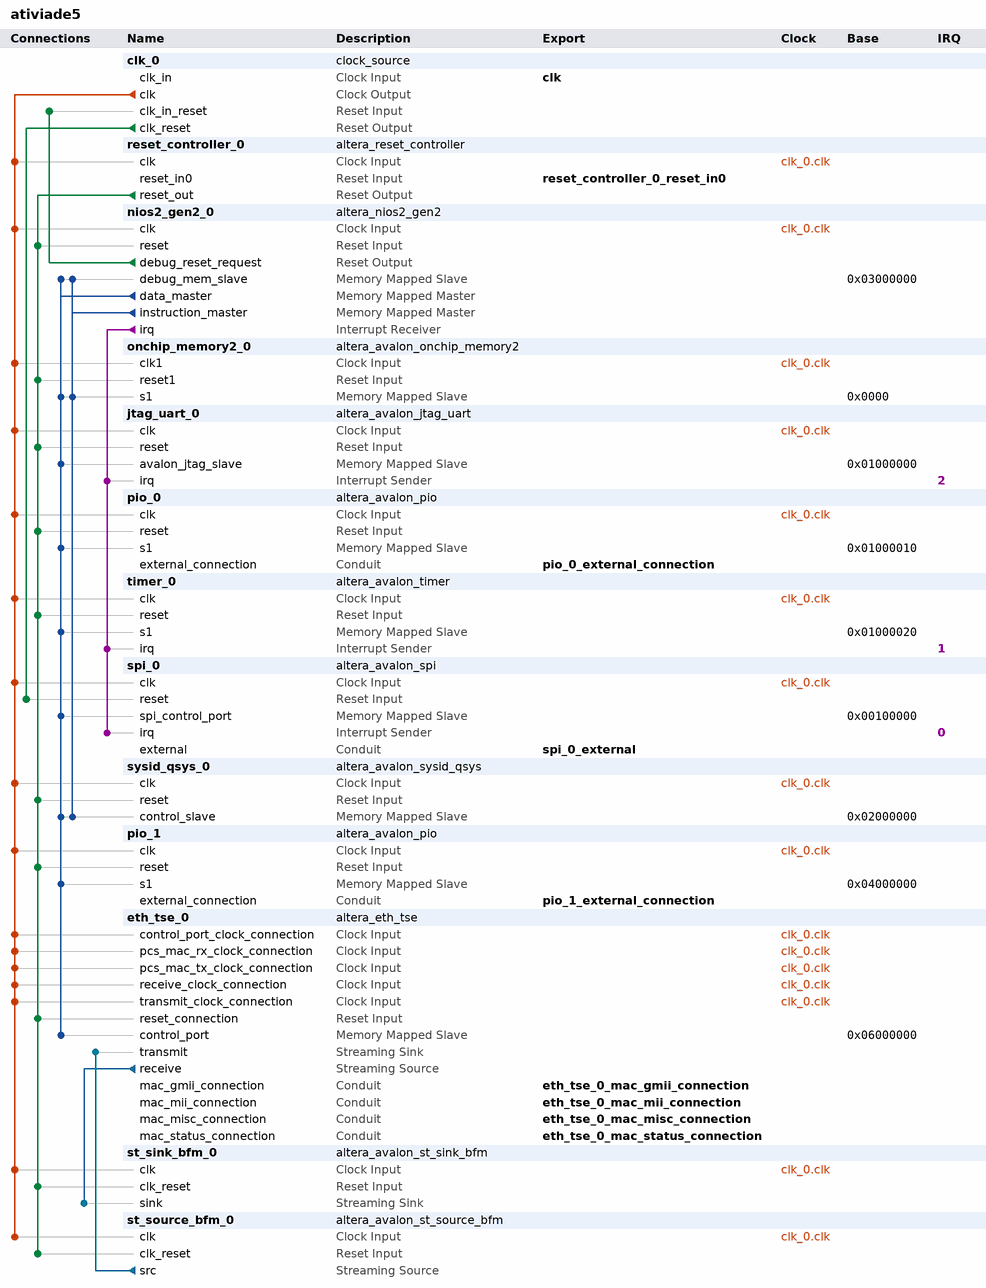
[diagram p0: system contents]
# Platform Designer (Qsys) system ativiade5, Cyclone V 5CSEMA5F31C6
# Parameters at their usual value, and those the tool derives, are not listed.
package require -exact qsys 17.0
create_system ativiade5
set_project_property DEVICE_FAMILY {Cyclone V}
set_project_property DEVICE 5CSEMA5F31C6

add_instance clk_0 clock_source 17.0
set_instance_parameter_value clk_0 clockFrequency 50000000

add_instance reset_controller_0 altera_reset_controller 17.0
set_instance_parameter_value reset_controller_0 NUM_RESET_INPUTS 1
set_instance_parameter_value reset_controller_0 SYNC_DEPTH 2

add_instance nios2_gen2_0 altera_nios2_gen2 17.0
set_instance_parameter_value nios2_gen2_0 dcache_size 2048
set_instance_parameter_value nios2_gen2_0 exceptionSlave onchip_memory2_0.s1
set_instance_parameter_value nios2_gen2_0 icache_size 4096
set_instance_parameter_value nios2_gen2_0 impl Tiny
set_instance_parameter_value nios2_gen2_0 resetSlave onchip_memory2_0.s1

add_instance onchip_memory2_0 altera_avalon_onchip_memory2 17.0
set_instance_parameter_value onchip_memory2_0 dataWidth 32
set_instance_parameter_value onchip_memory2_0 dualPort false
set_instance_parameter_value onchip_memory2_0 initMemContent true
set_instance_parameter_value onchip_memory2_0 initializationFileName onchip_mem.hex
set_instance_parameter_value onchip_memory2_0 memorySize 357300

add_instance jtag_uart_0 altera_avalon_jtag_uart 17.0
set_instance_parameter_value jtag_uart_0 simInteractiveOptions NO_INTERACTIVE_WINDOWS

add_instance pio_0 altera_avalon_pio 17.0
set_instance_parameter_value pio_0 captureEdge true
set_instance_parameter_value pio_0 direction Input
set_instance_parameter_value pio_0 width 10

add_instance timer_0 altera_avalon_timer 17.0
set_instance_parameter_value timer_0 period 1
set_instance_parameter_value timer_0 periodUnits MSEC

add_instance spi_0 altera_avalon_spi 17.0
set_instance_parameter_value spi_0 clockPolarity 0
set_instance_parameter_value spi_0 dataWidth 8
set_instance_parameter_value spi_0 masterSPI true
set_instance_parameter_value spi_0 numberOfSlaves 1
set_instance_parameter_value spi_0 targetClockRate 128000

add_instance sysid_qsys_0 altera_avalon_sysid_qsys 17.0
set_instance_parameter_value sysid_qsys_0 id 0

add_instance pio_1 altera_avalon_pio 17.0
set_instance_parameter_value pio_1 captureEdge true
set_instance_parameter_value pio_1 direction Input
set_instance_parameter_value pio_1 width 1

add_instance eth_tse_0 altera_eth_tse 17.0
set_instance_parameter_value eth_tse_0 core_variation MAC_ONLY
set_instance_parameter_value eth_tse_0 enable_hd_logic true
set_instance_parameter_value eth_tse_0 enable_mac_flow_ctrl false
set_instance_parameter_value eth_tse_0 enable_magic_detect true
set_instance_parameter_value eth_tse_0 enable_shift16 false
set_instance_parameter_value eth_tse_0 ifGMII MII_GMII
set_instance_parameter_value eth_tse_0 ing_addr 11
set_instance_parameter_value eth_tse_0 mdio_clk_div 40
set_instance_parameter_value eth_tse_0 stat_cnt_ena true
set_instance_parameter_value eth_tse_0 transceiver_type NONE
set_instance_parameter_value eth_tse_0 useMDIO false

add_instance st_sink_bfm_0 altera_avalon_st_sink_bfm 17.0
set_instance_parameter_value st_sink_bfm_0 ST_CHANNEL_W 1
set_instance_parameter_value st_sink_bfm_0 ST_ERROR_W 1
set_instance_parameter_value st_sink_bfm_0 ST_MAX_CHANNELS 1
set_instance_parameter_value st_sink_bfm_0 ST_NUMSYMBOLS 4
set_instance_parameter_value st_sink_bfm_0 ST_READY_LATENCY 0
set_instance_parameter_value st_sink_bfm_0 ST_SYMBOL_W 8
set_instance_parameter_value st_sink_bfm_0 USE_CHANNEL 1
set_instance_parameter_value st_sink_bfm_0 USE_EMPTY 1
set_instance_parameter_value st_sink_bfm_0 USE_ERROR 0
set_instance_parameter_value st_sink_bfm_0 USE_PACKET 1
set_instance_parameter_value st_sink_bfm_0 USE_READY 0
set_instance_parameter_value st_sink_bfm_0 USE_VALID 0
set_instance_parameter_value st_sink_bfm_0 VHDL_ID 0

add_instance st_source_bfm_0 altera_avalon_st_source_bfm 17.0
set_instance_parameter_value st_source_bfm_0 ST_CHANNEL_W 1
set_instance_parameter_value st_source_bfm_0 ST_ERROR_W 1
set_instance_parameter_value st_source_bfm_0 ST_MAX_CHANNELS 1
set_instance_parameter_value st_source_bfm_0 ST_NUMSYMBOLS 4
set_instance_parameter_value st_source_bfm_0 ST_SYMBOL_W 8
set_instance_parameter_value st_source_bfm_0 USE_CHANNEL 1
set_instance_parameter_value st_source_bfm_0 USE_EMPTY 1
set_instance_parameter_value st_source_bfm_0 USE_ERROR 0
set_instance_parameter_value st_source_bfm_0 USE_PACKET 1
set_instance_parameter_value st_source_bfm_0 USE_READY 0
set_instance_parameter_value st_source_bfm_0 USE_VALID 0

# connections
add_connection clk_0.clk eth_tse_0.control_port_clock_connection clock
add_connection clk_0.clk eth_tse_0.pcs_mac_rx_clock_connection clock
add_connection clk_0.clk eth_tse_0.pcs_mac_tx_clock_connection clock
add_connection clk_0.clk eth_tse_0.receive_clock_connection clock
add_connection clk_0.clk eth_tse_0.transmit_clock_connection clock
add_connection clk_0.clk jtag_uart_0.clk clock
add_connection clk_0.clk nios2_gen2_0.clk clock
add_connection clk_0.clk onchip_memory2_0.clk1 clock
add_connection clk_0.clk pio_0.clk clock
add_connection clk_0.clk pio_1.clk clock
add_connection clk_0.clk reset_controller_0.clk clock
add_connection clk_0.clk spi_0.clk clock
add_connection clk_0.clk st_sink_bfm_0.clk clock
add_connection clk_0.clk st_source_bfm_0.clk clock
add_connection clk_0.clk sysid_qsys_0.clk clock
add_connection clk_0.clk timer_0.clk clock
add_connection clk_0.clk_reset spi_0.reset reset
add_connection nios2_gen2_0.debug_reset_request clk_0.clk_in_reset reset
add_connection reset_controller_0.reset_out eth_tse_0.reset_connection reset
add_connection reset_controller_0.reset_out jtag_uart_0.reset reset
add_connection reset_controller_0.reset_out nios2_gen2_0.reset reset
add_connection reset_controller_0.reset_out onchip_memory2_0.reset1 reset
add_connection reset_controller_0.reset_out pio_0.reset reset
add_connection reset_controller_0.reset_out pio_1.reset reset
add_connection reset_controller_0.reset_out st_sink_bfm_0.clk_reset reset
add_connection reset_controller_0.reset_out st_source_bfm_0.clk_reset reset
add_connection reset_controller_0.reset_out sysid_qsys_0.reset reset
add_connection reset_controller_0.reset_out timer_0.reset reset
add_connection nios2_gen2_0.data_master eth_tse_0.control_port avalon
set_connection_parameter_value nios2_gen2_0.data_master/eth_tse_0.control_port baseAddress 0x06000000
add_connection nios2_gen2_0.data_master jtag_uart_0.avalon_jtag_slave avalon
set_connection_parameter_value nios2_gen2_0.data_master/jtag_uart_0.avalon_jtag_slave baseAddress 0x01000000
add_connection nios2_gen2_0.data_master nios2_gen2_0.debug_mem_slave avalon
set_connection_parameter_value nios2_gen2_0.data_master/nios2_gen2_0.debug_mem_slave baseAddress 0x03000000
add_connection nios2_gen2_0.data_master onchip_memory2_0.s1 avalon
set_connection_parameter_value nios2_gen2_0.data_master/onchip_memory2_0.s1 baseAddress 0x0000
add_connection nios2_gen2_0.data_master pio_0.s1 avalon
set_connection_parameter_value nios2_gen2_0.data_master/pio_0.s1 baseAddress 0x01000010
add_connection nios2_gen2_0.data_master pio_1.s1 avalon
set_connection_parameter_value nios2_gen2_0.data_master/pio_1.s1 baseAddress 0x04000000
add_connection nios2_gen2_0.data_master spi_0.spi_control_port avalon
set_connection_parameter_value nios2_gen2_0.data_master/spi_0.spi_control_port baseAddress 0x00100000
add_connection nios2_gen2_0.data_master sysid_qsys_0.control_slave avalon
set_connection_parameter_value nios2_gen2_0.data_master/sysid_qsys_0.control_slave baseAddress 0x02000000
add_connection nios2_gen2_0.data_master timer_0.s1 avalon
set_connection_parameter_value nios2_gen2_0.data_master/timer_0.s1 baseAddress 0x01000020
add_connection nios2_gen2_0.instruction_master nios2_gen2_0.debug_mem_slave avalon
set_connection_parameter_value nios2_gen2_0.instruction_master/nios2_gen2_0.debug_mem_slave baseAddress 0x03000000
add_connection nios2_gen2_0.instruction_master onchip_memory2_0.s1 avalon
set_connection_parameter_value nios2_gen2_0.instruction_master/onchip_memory2_0.s1 baseAddress 0x0000
add_connection nios2_gen2_0.instruction_master sysid_qsys_0.control_slave avalon
set_connection_parameter_value nios2_gen2_0.instruction_master/sysid_qsys_0.control_slave baseAddress 0x02000000
add_connection eth_tse_0.receive st_sink_bfm_0.sink avalon_streaming
add_connection st_source_bfm_0.src eth_tse_0.transmit avalon_streaming
add_connection nios2_gen2_0.irq jtag_uart_0.irq interrupt
set_connection_parameter_value nios2_gen2_0.irq/jtag_uart_0.irq irqNumber 2
add_connection nios2_gen2_0.irq spi_0.irq interrupt
set_connection_parameter_value nios2_gen2_0.irq/spi_0.irq irqNumber 0
add_connection nios2_gen2_0.irq timer_0.irq interrupt
set_connection_parameter_value nios2_gen2_0.irq/timer_0.irq irqNumber 1

# exported interfaces
add_interface clk clock sink
set_interface_property clk EXPORT_OF clk_0.clk_in
add_interface eth_tse_0_mac_gmii_connection conduit end
set_interface_property eth_tse_0_mac_gmii_connection EXPORT_OF eth_tse_0.mac_gmii_connection
add_interface eth_tse_0_mac_mii_connection conduit end
set_interface_property eth_tse_0_mac_mii_connection EXPORT_OF eth_tse_0.mac_mii_connection
add_interface eth_tse_0_mac_misc_connection conduit end
set_interface_property eth_tse_0_mac_misc_connection EXPORT_OF eth_tse_0.mac_misc_connection
add_interface eth_tse_0_mac_status_connection conduit end
set_interface_property eth_tse_0_mac_status_connection EXPORT_OF eth_tse_0.mac_status_connection
add_interface pio_0_external_connection conduit end
set_interface_property pio_0_external_connection EXPORT_OF pio_0.external_connection
add_interface pio_1_external_connection conduit end
set_interface_property pio_1_external_connection EXPORT_OF pio_1.external_connection
add_interface reset_controller_0_reset_in0 reset sink
set_interface_property reset_controller_0_reset_in0 EXPORT_OF reset_controller_0.reset_in0
add_interface spi_0_external conduit end
set_interface_property spi_0_external EXPORT_OF spi_0.external

set_interconnect_requirement {$system} qsys_mm.clockCrossingAdapter HANDSHAKE
set_interconnect_requirement {$system} qsys_mm.enableEccProtection FALSE
set_interconnect_requirement {$system} qsys_mm.insertDefaultSlave FALSE
set_interconnect_requirement {$system} qsys_mm.maxAdditionalLatency 1

save_system ativiade5.qsys
